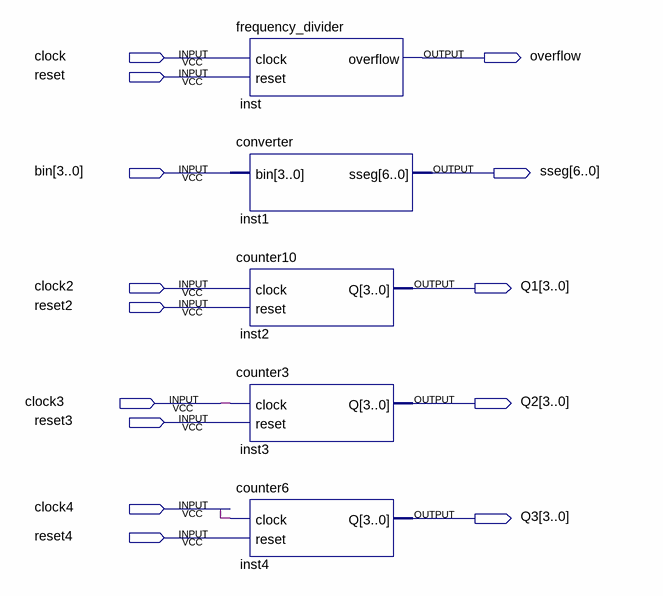
[diagram p0: schematic sheet]
// Quartus schematic main.bdf as structural Verilog: 5 symbols, 14 pins
module main (
  input  clock,
  input  reset,
  input  [3:0] bin,
  input  clock2,
  input  reset2,
  input  clock3,
  input  reset3,
  input  clock4,
  input  reset4,
  output overflow,
  output [6:0] sseg,
  output [3:0] Q1,
  output [3:0] Q2,
  output [3:0] Q3
);

  frequency_divider inst (.clock(clock), .reset(reset), .overflow(overflow));
  converter inst1 (.bin(bin), .sseg(sseg));
  counter10 inst2 (.clock(clock2), .reset(reset2), .Q(Q1));
  counter3 inst3 (.clock(clock3), .reset(reset3), .Q(Q2));
  counter6 inst4 (.clock(clock4), .reset(reset4), .Q(Q3));
endmodule
